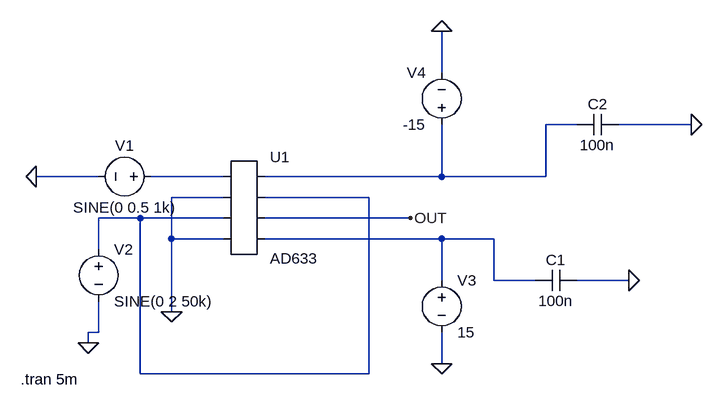
[diagram p0: schematic LAB1_Modulation.asc]
LAB1_Modulation.asc, the LTspice schematic file:
Version 4
SHEET 1 884 680
WIRE 480 -48 480 -112
WIRE 688 32 640 32
WIRE 864 32 752 32
WIRE -48 112 -144 112
WIRE 144 112 32 112
WIRE 480 112 480 32
WIRE 480 112 208 112
WIRE 640 112 640 32
WIRE 640 112 480 112
WIRE 144 144 64 144
WIRE 368 144 208 144
WIRE 16 176 -48 176
WIRE 144 176 16 176
WIRE 432 176 208 176
WIRE 64 208 64 144
WIRE 144 208 64 208
WIRE 480 208 208 208
WIRE 560 208 480 208
WIRE -48 224 -48 176
WIRE 480 272 480 208
WIRE 560 272 560 208
WIRE 624 272 560 272
WIRE 768 272 688 272
WIRE 64 320 64 208
WIRE -48 352 -48 304
WIRE -48 352 -64 352
WIRE -64 368 -64 352
WIRE 480 400 480 352
WIRE 16 416 16 176
WIRE 368 416 368 144
WIRE 368 416 16 416
FLAG 64 320 0
FLAG 768 272 0
FLAG 864 32 0
FLAG -144 112 0
FLAG -64 368 0
FLAG 480 400 0
FLAG 480 -112 0
FLAG 432 176 OUT
SYMBOL AutoGenerated\\AD633 176 160 R0
SYMATTR InstName U1
SYMBOL voltage 48 112 R90
WINDOW 0 -32 56 VBottom 2
WINDOW 3 32 56 VTop 2
WINDOW 123 0 0 Left 0
WINDOW 39 0 0 Left 0
SYMATTR InstName V1
SYMATTR Value SINE(0 0.5 1k)
SYMBOL voltage -48 208 R0
WINDOW 123 0 0 Left 0
WINDOW 39 0 0 Left 0
SYMATTR InstName V2
SYMATTR Value SINE(0 2 50k)
SYMBOL voltage 480 256 R0
WINDOW 123 0 0 Left 0
WINDOW 39 0 0 Left 0
SYMATTR InstName V3
SYMATTR Value 15
SYMBOL voltage 480 48 R180
WINDOW 0 24 96 Left 2
WINDOW 3 24 16 Left 2
WINDOW 123 0 0 Left 0
WINDOW 39 0 0 Left 0
SYMATTR InstName V4
SYMATTR Value -15
SYMBOL cap 688 256 R90
WINDOW 0 0 32 VBottom 2
WINDOW 3 32 32 VTop 2
SYMATTR InstName C1
SYMATTR Value 100n
SYMBOL cap 752 16 R90
WINDOW 0 0 32 VBottom 2
WINDOW 3 32 32 VTop 2
SYMATTR InstName C2
SYMATTR Value 100n
TEXT -168 424 Left 2 !.tran 5m

The netlist it stands for:
* LAB1_Modulation.asc
* U1: AD633 (symbol AutoGenerated\AD633 not available, pins judged from their places): pin1=N002 pin2=0 pin3=N003 pin4=0 pin5=N001 pin6=N003 pin7=OUT pin8=N004
V1 N002 0 SINE(0 0.5 1k)
V2 N003 0 SINE(0 2 50k)
V3 N004 0 15
V4 N001 0 -15
C1 0 N004 100n
C2 0 N001 100n
.tran 5m
.backanno
.end